# EasyEDA Pro project easyeda_project.epro, board PCB1
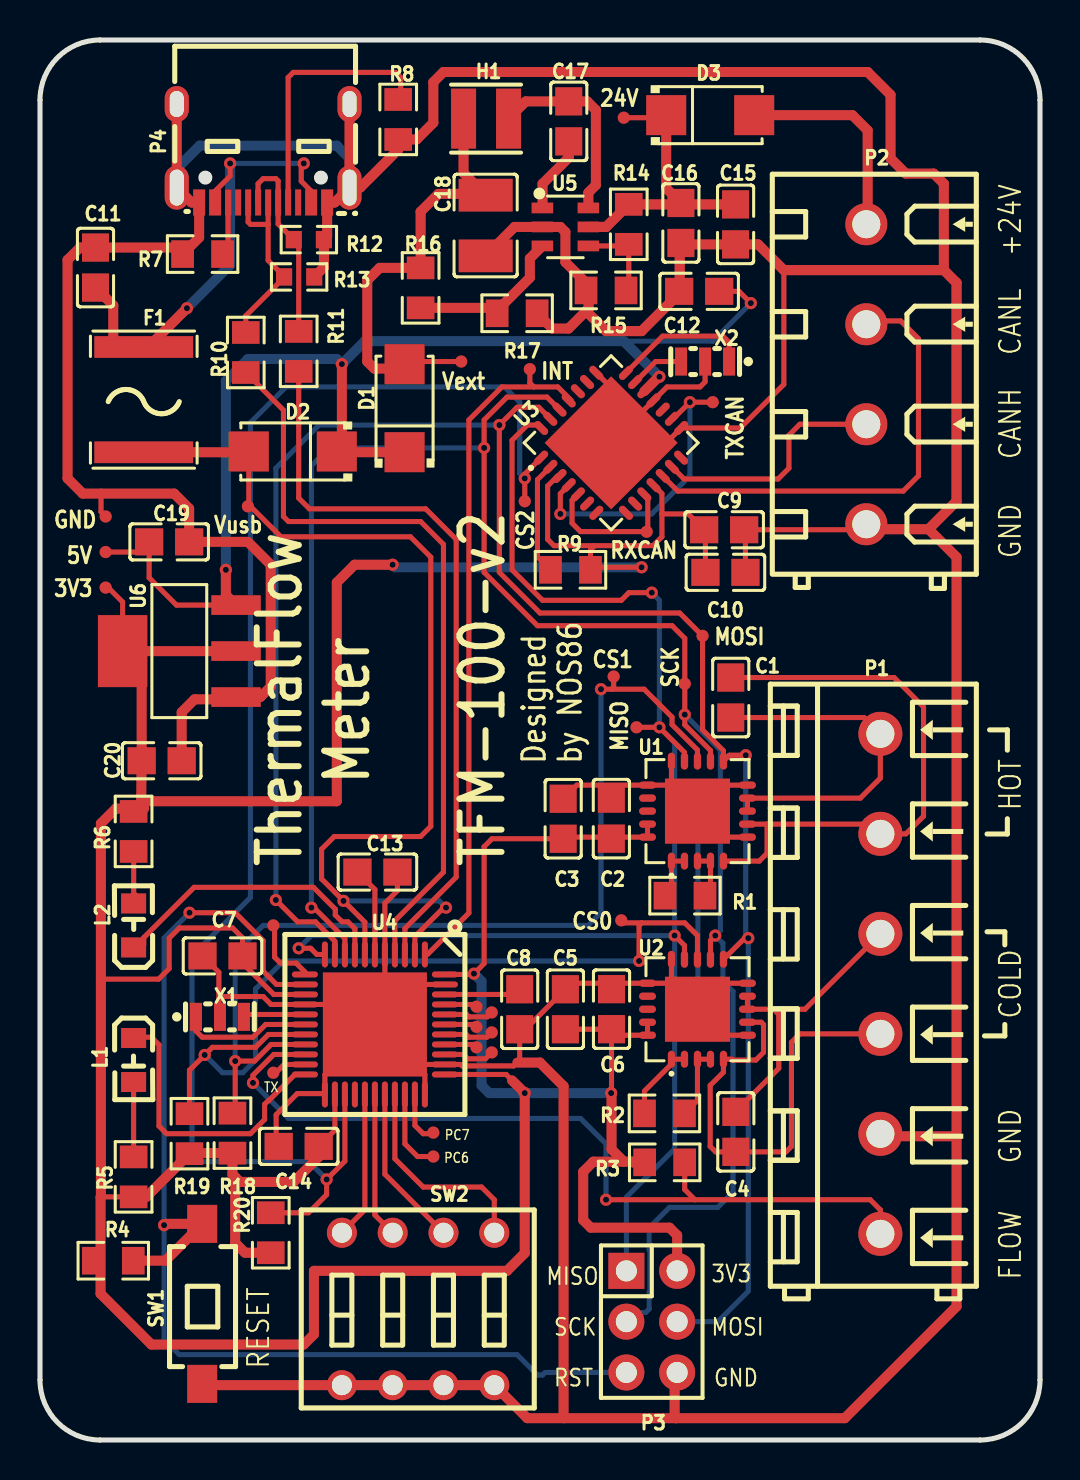
[diagram p3: board, top side]
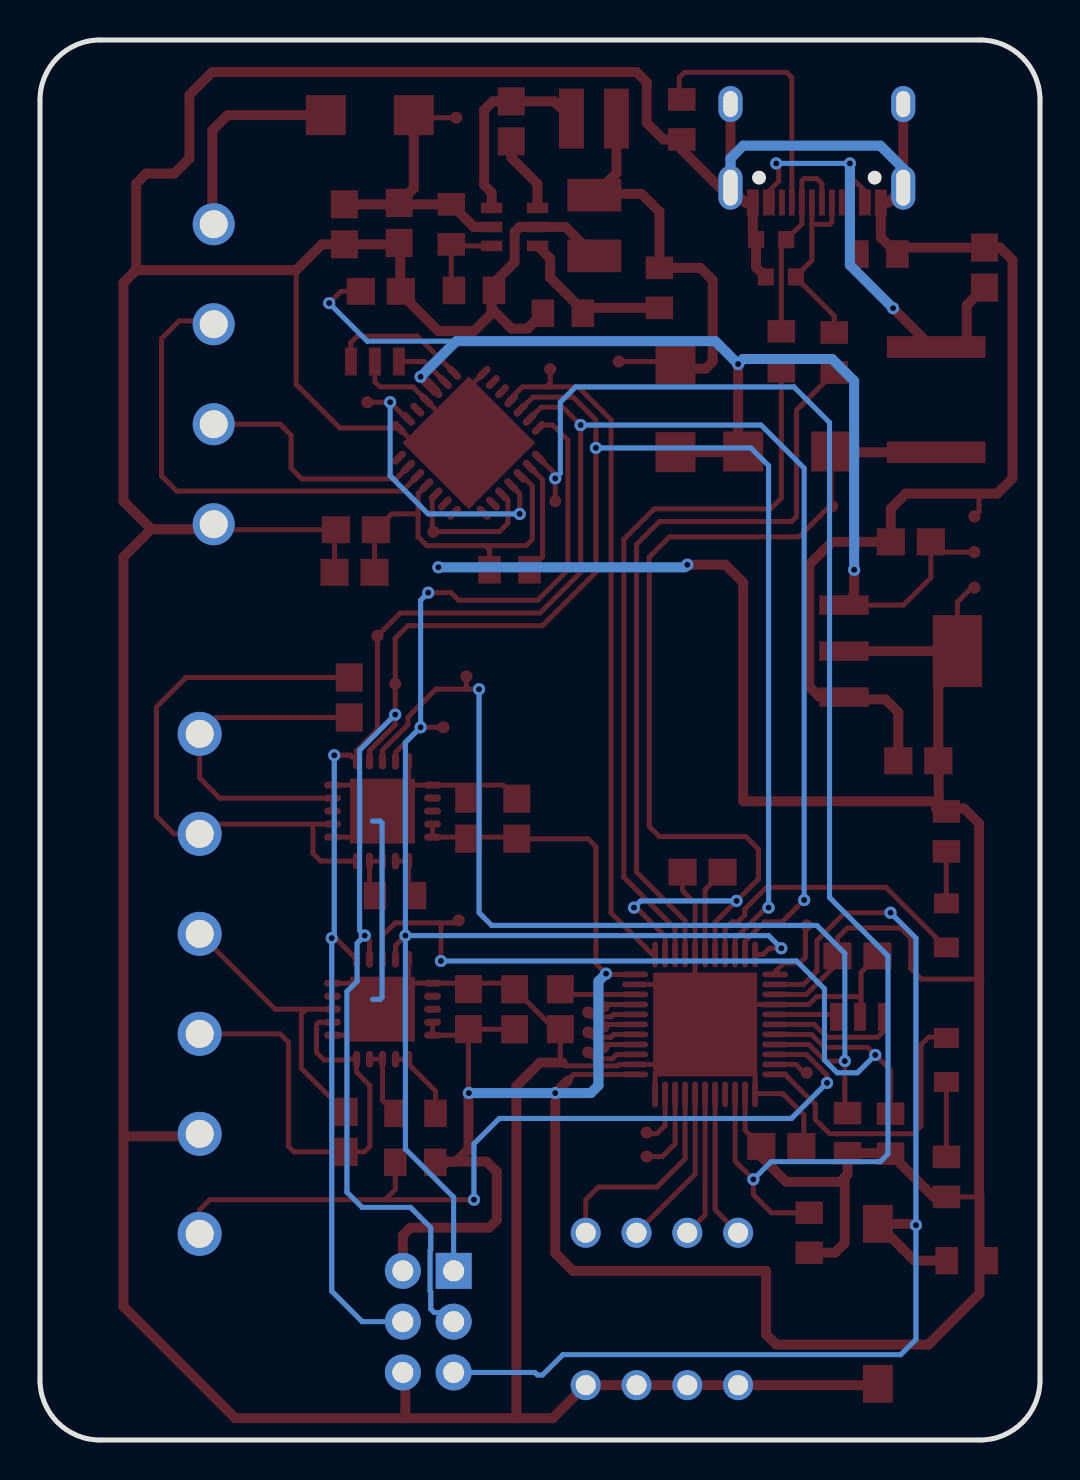
[diagram p4: board, bottom side, seen from below]

Outline 50 x 70 mm; copper layers: Top Layer, Bottom Layer. Coordinates in mm from the lower left corner of the outline.
Outline path: 0,67 arc(0.88,69.12) 3,70 47,70 arc(49.12,69.12) 50,67 50,3 arc(49.12,0.88) 47,0 3,0 arc(0.88,0.88) 0,3 0,67
Stack: Top Layer 0.035mm / Dielectric1 1.51mm FR4 er 4.5 / Bottom Layer 0.035mm

## Design rules (mm)
template: JLCPCB Capability(Two Layers Board)
spacing copperThickness1oz (default): track to track 0.102, other pairs 0.152 to 0.3
spacing copperThickness2oz: track to track 0.203, other pairs 0.152 to 0.3
track width copperThickness1oz (default): min 0.127, default 0.254, max 2.54
track width copperThickness2oz: min 0.203, default 0.254, max 2.54
differential pair differentialPair (default): width min 0.127, default 0.254, max 2.54; gap min 0.152, default 0.152
via viaSize (default): diameter min 0.5, default 0.61, max 10; hole min 0.3, default 0.305, max 6.3

## Placement (name value [footprint] x y rotation side)
C1  100nF  [C0805]  34.54 37.12 270 top
C2  100nF  [C0805]  28.57 31.07 270 top
C3  100nF  [C0805]  26.16 31.06 270 top
C4  100nF  [C0805]  34.79 15.41 270 top
C5  100nF  [C0805]  26.27 21.54 270 top
C6  100nF  [C0805]  28.58 21.54 270 top
C7  100nF  [C0805]  9.12 24.2 180 top
C8  100nF  [C0805]  23.98 21.54 270 top
C9  100nF  [C0805]  34.21 45.51 180 top
C10  100nF  [C0805]  34.27 43.38 180 top
C11  10uF  [C0805]  2.78 58.62 90 top
C12  100nF  [C0805]  32.96 57.43 180 top
C13  1uF  [C0805]  16.87 28.4 180 top
C14  1uF  [C0805]  12.94 14.68 0 top
C15  4.7uF  [C0805]  34.78 60.78 90 top
C16  100nF  [C0805]  32.04 60.85 90 top
C17  100nF  [C0805]  26.44 65.93 90 top
C18  15uF  [C1210]  22.28 60.72 90 top
C19  10uF  [C0805]  6.46 44.91 180 top
C20  22uF  [C0805]  6.09 33.96 180 top
D1  SS14  [SMA_L4.3-W2.6-LS5.1-RD]  18.23 51.59 90 top
D2  SS14  [SMA_L4.3-W2.6-LS5.1-RD]  12.64 49.43 180 top
D3  SS14  [SMA_L4.3-W2.6-LS5.1-RD]  33.51 66.24 0 top
F1  MF-SMDF050-2  [F2018]  5.19 52.02 270 top
H1  100uH  [IND-SMD_L3.5-W3.0_SLF0302]  22.3 66.07 0 top
L1  XL-2012SURC  [LED0805-RD_RED]  4.68 19 270 top
L2  XL-2012SURC  [LED0805-RD_RED]  4.68 25.73 90 top
NOREF  -  [Pad_e244]  24.49 53.54 0 top
NOREF#2  -  [Pad_e5210]  19.67 15.37 0 top
NOREF#3  -  [Pad_e318]  33.64 51.89 0 top
NOREF#4  -  [Pad_e5227]  22.59 20.38 0 top
NOREF#5  -  [Pad_e3099]  3.28 46.18 0 top
NOREF#6  -  [Pad_e5274]  11.66 25.73 0 top
NOREF#7  -  [Pad_e233]  32.24 37.81 0 top
NOREF#8  -  [Pad_e3172]  21.06 53.92 0 top
NOREF#9  -  [Pad_e5225]  21.82 19.63 0 top
NOREF#10  -  [Pad_e3178]  29.19 66.11 0 top
NOREF#11  -  [Pad_e5223]  21.82 21.67 0 top
NOREF#12  -  [Pad_e5228]  22.59 21.38 0 top
NOREF#13  -  [Pad_e3098]  3.28 44.4 0 top
NOREF#14  -  [Pad_e3100]  3.28 42.62 0 top
NOREF#15  -  [Pad_e5209]  19.67 14.17 0 top
NOREF#16  -  [Pad_e226]  29.06 25.98 0 top
NOREF#17  -  [Pad_e5224]  21.82 20.66 0 top
NOREF#18  -  [Pad_e240]  29.83 35.64 0 top
NOREF#19  -  [Pad_e245]  24.24 46.94 0 top
NOREF#20  -  [Pad_e5226]  22.59 19.38 0 top
NOREF#21  -  [Pad_e5189]  11.66 18.36 0 top
NOREF#22  -  [Pad_e3171]  10.4 46.68 0 top
NOREF#23  -  [Pad_e255]  30.33 45.41 0 top
NOREF#24  -  [Pad_e232]  28.68 38.17 0 top
NOREF#25  -  [Pad_e239]  33.13 40.21 0 top
P1  MX128-5.0-06P-GN01-Cu-Y-A  [CONN-TH_6P-P5.00_MX128-5.0-06P-GN01-CU-Y-A]  42.02 22.81 90 top
P2  MX128-5.0-04P-GN01-Cu-Y-A  [CONN-TH_4P-MX128-5.0-04P-GN01-CU-Y-A]  41.32 53.29 90 top
P3  2.54-2*3P针  [HDR-TH_6P-P2.54-V-M-R2-C3-S2.54-1]  30.59 5.92 270 top
P4  U262-161N-4BVC11  [USB-3.1-SMD_U262-161N-4BVC11]  11.16 64.34 180 top
R1  400Ω  [R0805]  32.25 27.22 180 top
R2  400Ω  [R0805]  31.22 16.33 180 top
R3  10kΩ  [R0805]  31.23 13.88 180 top
R4  10kΩ  [R0805]  3.66 8.97 0 top
R5  1kΩ  [R0805]  4.68 13.16 270 top
R6  1kΩ  [R0805]  4.68 30.43 90 top
R7  5.1kΩ  [R0805]  8.13 59.3 180 top
R8  5.1kΩ  [R0805]  17.91 66.03 90 top
R9  10kΩ  [R0805]  26.52 43.51 180 top
R10  22Ω  [R0805]  10.29 54.38 270 top
R11  22Ω  [R0805]  12.94 54.43 270 top
R12  CG0603MLC-05E  [R0603]  13.44 60.02 180 top
R13  CG0603MLC-05E  [R0603]  12.96 58.15 180 top
R14  953kΩ  [R0805]  29.44 60.78 90 top
R15  332kΩ  [R0805]  28.3 57.48 0 top
R16  95.3kΩ  [R0805]  19.03 57.61 90 top
R17  22.1kΩ  [R0805]  23.86 56.34 180 top
R18  10kΩ  [R0805]  9.62 15.34 90 top
R19  10kΩ  [R0805]  7.47 15.31 90 top
R20  10kΩ  [R0805]  11.54 10.36 90 top
SW1  TS-1101-C-W  [SW-SMD_L6.0-W3.3-LS8.0]  8.11 6.81 90 top
SW2  SMQS-04R-TP  [SW-TH_8P-P2.54_SMQS-04R-TP]  18.9 6.55 180 top
U1  MAX31865ATP+T  [QFN-20_L5.0-W5.0-P0.65-BL-EP]  32.87 31.44 0 top
U2  MAX31865ATP+T  [QFN-20_L5.0-W5.0-P0.65-BL-EP]  32.87 21.54 0 top
U3  MCP25625-E/ML  [QFN-28_L6.0-W6.0-P0.65-BL-EP]  28.56 49.86 315 top
U4  ATMEGA32U4-MU  [VQFN-44_L7.0-W7.0-P0.50-BL-EP5.2]  16.75 20.78 180 top
U5  TPS560430XDBVR  [SOT-23-6_L2.9-W1.6-P0.95-LS2.8-BL]  26.27 60.65 270 top
U6  AMS1117-3.3V  [SOT-223-4_L6.5-W3.5-P2.30-LS7.0-TR]  6.97 39.44 90 top
X1  8MHz  [OSC-SMD_3P-L3.2-W1.3-P1.20-L]  9 21.16 0 top
X2  8MHz  [OSC-SMD_3P-L3.2-W1.3-P1.20-L]  33.25 53.92 180 top

## Footprints (pads in the part's own frame, mm; a bottom-side part is the same pattern mirrored in y, then rotated)
C0805
  rect 1.41x1.35 smd: 1(-1,0) 2(1,0)
C1210
  rect 1.635x2.7 smd: 1(-1.518,0) 2(1.518,0)
CONN-TH_4P-MX128-5.0-04P-GN01-CU-Y-A
  round 2.1 hole 1.4: 1(-7.5,0) 2(-2.5,0) 3(2.5,0) 4(7.5,0)
CONN-TH_6P-P5.00_MX128-5.0-06P-GN01-CU-Y-A
  round 2.2 hole 1.4: 1(-12.5,0) 2(-7.5,0) 3(-2.5,0) 4(2.5,0) 5(7.5,0) 6(12.5,0)
F2018
  rect 1.083x4.941 smd: 1(-2.632,0) 2(2.632,0)
HDR-TH_6P-P2.54-V-M-R2-C3-S2.54-1
  rect 1.8x1.8 hole 1.05: 1(-2.54,-1.27)
  round 1.8 hole 1.05: 2(-2.54,1.27) 3(0,-1.27) 4(0,1.27) 5(2.54,-1.27) 6(2.54,1.27)
IND-SMD_L3.5-W3.0_SLF0302
  rect 1.25x3 smd: 1(-1.125,0) 2(1.125,0)
LED0805-RD_RED
  rect 1x1.25 smd: 1(-1.1,0) 2(1.1,0)
OSC-SMD_3P-L3.2-W1.3-P1.20-L
  rect 0.6x1.4 smd: 1(-1.199,0) 2(0,0) 3(1.199,0)
Pad_e226
  round 0.61 smd: TP1(0,0)
Pad_e232
  round 0.61 smd: TP2(0,0)
Pad_e233
  round 0.61 smd: TP3(0,0)
Pad_e239
  round 0.61 smd: TP4(0,0)
Pad_e240
  round 0.61 smd: TP5(0,0)
Pad_e244
  round 0.61 smd: TP6(0,0)
Pad_e245
  round 0.61 smd: TP7(0,0)
Pad_e255
  round 0.61 smd: TP8(0,0)
Pad_e318
  round 0.61 smd: TP9(0,0)
Pad_e3098
  round 0.61 smd: TP1(0,0)
Pad_e3099
  round 0.61 smd: TP2(0,0)
Pad_e3100
  round 0.61 smd: TP3(0,0)
Pad_e3171
  round 0.61 smd: TP4(0,0)
Pad_e3172
  round 0.61 smd: TP5(0,0)
Pad_e3178
  round 0.61 smd: TP6(0,0)
Pad_e5189
  round 0.61 smd: TP9(0,0)
Pad_e5209
  round 0.61 smd: TP11(0,0)
Pad_e5210
  round 0.61 smd: TP12(0,0)
Pad_e5223
  round 0.61 smd: TP13(0,0)
Pad_e5224
  round 0.61 smd: TP14(0,0)
Pad_e5225
  round 0.61 smd: TP15(0,0)
Pad_e5226
  round 0.61 smd: TP16(0,0)
Pad_e5227
  round 0.61 smd: TP17(0,0)
Pad_e5228
  round 0.61 smd: TP14(0,0)
Pad_e5274
  round 0.61 smd: TP18(0,0)
QFN-20_L5.0-W5.0-P0.65-BL-EP
  oval 0.364x0.847 smd: 1(-1.3,-2.498) 2(-0.65,-2.498) 3(0,-2.498) 4(0.65,-2.498) 5(1.3,-2.498) 11(1.3,2.498) 12(0.65,2.498) 13(0,2.498) 14(-0.65,2.498) 15(-1.3,2.498)
  oval 0.847x0.364 smd: 6(2.498,-1.3) 7(2.498,-0.65) 8(2.498,0) 9(2.498,0.65) 10(2.498,1.3) 16(-2.498,1.3) 17(-2.498,0.65) 18(-2.498,0) 19(-2.498,-0.65) 20(-2.498,-1.3)
  rect 3.25x3.25 smd: 21(0,0)
QFN-28_L6.0-W6.0-P0.65-BL-EP
  oval 0.364x0.847 smd: 1(-1.95,-2.998) 2(-1.3,-2.998) 3(-0.65,-2.998) 4(0,-2.998) 5(0.65,-2.998) 6(1.3,-2.998) 7(1.95,-2.998) 15(1.95,2.998) 16(1.3,2.998) 17(0.65,2.998) 18(0,2.998) 19(-0.65,2.998) 20(-1.3,2.998) 21(-1.95,2.998)
  oval 0.847x0.364 smd: 8(2.998,-1.95) 9(2.998,-1.3) 10(2.998,-0.65) 11(2.998,0) 12(2.998,0.65) 13(2.998,1.3) 14(2.998,1.95) 22(-2.998,1.95) 23(-2.998,1.3) 24(-2.998,0.65) 25(-2.998,0) 26(-2.998,-0.65) 27(-2.998,-1.3) 28(-2.998,-1.95)
  rect 4.7x4.7 smd: 29(0,0)
R0603
  rect 0.806x0.864 smd: 1(-0.753,0) 2(0.753,0)
R0805
  rect 1.133x1.377 smd: 1(-1,0) 2(1,0)
SMA_L4.3-W2.6-LS5.1-RD
  rect 2x2 smd: 1(-2.2,0) 2(2.2,0)
SOT-23-6_L2.9-W1.6-P0.95-LS2.8-BL
  rect 0.532x1.072 smd: 1(-0.95,-1.149) 2(0,-1.149) 3(0.95,-1.149) 4(0.95,1.149) 5(0,1.149) 6(-0.95,1.149)
SOT-223-4_L6.5-W3.5-P2.30-LS7.0-TR
  rect 0.98x2.47 smd: 1(-2.3,-2.835) 2(0,-2.835) 3(2.3,-2.835)
  rect 3.6x2.47 smd: 4(0,2.835)
SW-SMD_L6.0-W3.3-LS8.0
  rect 1.9x1.5 smd: 1(-4,0) 2(4,0)
SW-TH_8P-P2.54_SMQS-04R-TP
  round 1.5 hole 1: 1(-3.81,-3.81) 2(-1.27,-3.81) 3(1.27,-3.81) 4(3.81,-3.81) 5(3.81,3.81) 6(1.27,3.81) 7(-1.27,3.81) 8(-3.81,3.81)
USB-3.1-SMD_U262-161N-4BVC11
  rect 0.6x1.3 smd: A1B12(-3.2,2.462) A4B9(-2.4,2.462) B1A12(3.2,2.462) B4A9(2.4,2.462)
  rect 0.3x1.3 smd: A5(-1.25,2.462) A6(-0.25,2.462) A7(0.25,2.462) A8(1.25,2.462) B5(1.75,2.462) B6(0.75,2.462) B7(-0.75,2.462) B8(-1.75,2.462)
  oval 1.2x2.2 hole 0.7x1.8: SHELL(-4.32,1.719) SHELL(4.32,1.719)
  oval 1.2x1.8 hole 0.7x1.3: SHELL(-4.32,-2.462) SHELL(4.32,-2.462)
VQFN-44_L7.0-W7.0-P0.50-BL-EP5.2
  oval 0.3x1.3 smd: 1(-2.5,-3.5) 2(-2,-3.5) 3(-1.5,-3.5) 4(-1,-3.5) 5(-0.5,-3.5) 6(0,-3.5) 7(0.5,-3.5) 8(1,-3.5) 9(1.5,-3.5) 10(2,-3.5) 11(2.5,-3.5) 23(2.5,3.5) 24(2,3.5) 25(1.5,3.5) 26(1,3.5) 27(0.5,3.5) 28(0,3.5) 29(-0.5,3.5) 30(-1,3.5) 31(-1.5,3.5) 32(-2,3.5) 33(-2.5,3.5)
  oval 1.3x0.3 smd: 12(3.5,-2.5) 13(3.5,-2) 14(3.5,-1.5) 15(3.5,-1) 16(3.5,-0.5) 17(3.5,0) 18(3.5,0.5) 19(3.5,1) 20(3.5,1.5) 21(3.5,2) 22(3.5,2.5) 34(-3.5,2.5) 35(-3.5,2) 36(-3.5,1.5) 37(-3.5,1) 38(-3.5,0.5) 39(-3.5,0) 40(-3.5,-0.5) 41(-3.5,-1) 42(-3.5,-1.5) 43(-3.5,-2) 44(-3.5,-2.5)
  rect 5.2x5.2 smd: 45(0,0)

## Nets
+5V: C12.1 C19.2 D1.1 D2.1 NOREF#13.TP1 U3.19 U6.3
+24V: C15.2 C16.2 D3.1 NOREF#10.TP6 R14.2 U5.5
GND: C2.1 C3.1 C5.1 C6.1 C7.2 C8.2 C9.1 C10.1 C11.2 C12.2 C13.1 C14.1 C15.1 C16.1 C18.1 C19.1 C20.1 NOREF#5.TP2 P1.2 P2.1 P3.6 P4.A1B12 P4.B1A12 P4.SHELL R7.2 R8.1 R12.1 R13.1 R15.1 R17.1 SW1.1 SW2.5 SW2.6 SW2.7 SW2.8 U1.6 U1.10 U1.15 U1.16 U1.21 U2.6 U2.10 U2.15 U2.16 U2.21 U3.15 U3.18 U3.22 U3.29 U4.5 U4.15 U4.23 U4.33 U4.35 U4.43 U4.45 U5.2 U6.1 X1.2 X2.2
VCC: C2.2 C3.2 C5.2 C6.2 C7.1 C9.2 C10.2 C14.2 C20.2 NOREF#14.TP3 P3.2 R3.2 R4.1 R5.2 R6.2 R9.1 R18.1 R19.1 R20.1 U1.19 U1.20 U2.19 U2.20 U3.3 U3.11 U4.14 U4.24 U4.34 U4.44 U6.2 U6.4
CANH: P2.2 U3.13
CANL: P2.3 U3.12
CS0: NOREF#16.TP1 R19.2 U2.13 U4.18
CS1: NOREF#24.TP2 R18.2 U1.13 U4.19
CS2: NOREF#19.TP7 R20.2 U3.1 U4.25
D6: SW2.4 U4.27
D8: SW2.3 U4.28
D9: SW2.2 U4.29
D10: SW2.1 U4.30
D17: L2.1 U4.8
D30: L1.1 U4.22
DN: R11.2 U4.3
DP: R10.2 U4.4
FLOW: P1.1 R3.1 U4.20
INT: NOREF.TP6 U3.25 U4.1
MISO: NOREF#18.TP5 P3.1 U1.14 U2.14 U3.28 U4.11
MOSI: NOREF#25.TP4 P3.4 U1.11 U2.11 U3.27 U4.10
RESET: P3.5 R4.2 SW1.2 U4.13
SCK: NOREF#7.TP3 P3.3 U1.12 U2.12 U3.26 U4.9
VUSB: D2.2 F1.2 NOREF#22.TP4 U4.2 U4.7
$1N891: R1.2 U1.1 U1.2
$1N897: R1.1 U1.3 U1.4
$1N1195: R2.2 U2.1 U2.2
$1N1200: R2.1 U2.3 U2.4
$1N4720: C4.1 P1.4 U2.8 U2.9
$1N4751: C1.1 P1.5 U1.5 U1.7
$1N4770: C1.2 P1.6 U1.8 U1.9
$1N4790: C4.2 P1.3 U2.5 U2.7
$2N8089: U4.17 X1.1
$2N8095: U4.16 X1.3
$2N9383: C8.1 U4.42
$2N9499: C13.2 U4.6
$2N9903: L1.2 R5.1
$2N9904: L2.2 R6.1
$4N1497: C11.1 F1.1 P4.A4B9 P4.B4A9
$4N1722: P4.A5 R8.2
$4N1785: P4.B5 R7.1
$4N2171: P4.A7 P4.B7 R11.1 R12.2
$4N2188: P4.A6 P4.B6 R10.1 R13.2
$4N5071: NOREF#23.TP8 U3.5 U3.10
$4N5075: U3.20 X2.3
$4N5076: U3.21 X2.1
$4N5081: NOREF#3.TP9 U3.4 U3.16
$4N5085: R9.2 U3.2
$4N6848: C17.1 U5.1
$4N6852: C17.2 H1.2 U5.6
$4N7229: C18.2 D1.2 H1.1 NOREF#8.TP5 R16.2
$4N7245: R16.1 R17.2 U5.3
$4N7394: R14.1 R15.2 U5.4
$4N8485: D3.2 P2.4

Pads without a net: NOREF#2 TP12; NOREF#4 TP17; NOREF#6 TP18; NOREF#9 TP15; NOREF#11 TP13; NOREF#12 TP14; NOREF#15 TP11; NOREF#17 TP14; NOREF#20 TP16; NOREF#21 TP9; P4 A8 B8; U1 17 18; U2 17 18; U3 6 7 8 9 14 17 23 24; U4 12 21 26 31 32 36 37 38 39 40 41

## Via types
v1: diameter 0.61, hole 0.305, Top Layer to Bottom Layer, 38 vias

## Routing (per net, layer and track width the routed paths; a pad name or vN(x,y) marks a point on that pad's centre or on a via; arc(x,y) is an arc through that point)
+5V: length 61.5
  Top Layer w0.254: NOREF#13.TP1 4.95,44.4 C19.2 5.46,43.11 6.82,41.75 9.8,41.75 ; v1(35.54,56.84) 34.95,57.43 C12.1
  Top Layer w0.5: v1(15.09,53.8) 15.09,49.44 15.14,49.39 18.23,49.39 ; 30.22,52.44 30.94,53.16 v1(30.97,53.16) ; v1(9.29,43.51) 9.29,42.25 9.8,41.75
  Bottom Layer w0.254: 29.19,54.94 33.64,54.94 v1(35.54,56.84)
  Bottom Layer w0.5: v1(30.97,53.16) 29.19,54.94 16.24,54.94 v1(15.09,53.8) 14.84,54.05 10.4,54.05 9.29,52.95 v1(9.29,43.51)
+24V: length 14.7
  Top Layer w0.254: D3.1 31.18,66.11 NOREF#10.TP6
  Top Layer w0.5: D3.1 31.31,62.59 C16.2
  Top Layer w0.508: C15.2 29.44,61.78 R14.2 28.31,60.65 U5.5
GND: length 392.1
  Top Layer w0.254: X2.2 33.25,52.91 33,52.65 31.35,52.65 U3.18 U3.29 ; U1.6 34.17,30.14 U1.21 ; 8.95,21.99 9.12,22.17 11.16,22.17 11.55,21.78 U4.15 15.75,21.78 U4.45 ; 8.95,21.99 8.95,23.38 C7.2 ; 8.95,21.99 8.95,21.21 X1.2 ; 11.81,14.68 11.81,16.26 12.86,17.32 14.2,17.32 U4.23 14.25,18.28 U4.45 ; U3.29 31.31,49.86 U3.15 35.01,50.6 37.19,52.78 37.19,58.5 ; U3.29 28.56,52.62 U3.22 ; 18.75,18.78 U4.45 ; 18.75,18.78 19.25,18.28 U4.33 ; 18.75,18.78 U4.35 21.03,18.78 21.1,18.7 23.69,18.7 23.98,19 C8.2 24.27,20.54 C5.1 26.57,22.84 U2.16 31.57,22.84 U2.15 ; U2.6 34.17,20.24 U2.21 ; U2.21 34.17,22.84 U2.10 ; U2.21 32.37,22.04 ; U1.10 34.17,32.74 U1.21 ; P2.1 41.04,45.51 C9.1 35.27,45.45 C10.1 ; 3.05,47.32 3.05,46.41 NOREF#5.TP2 ; U1.21 32.37,31.94 ; C13.1 17.87,27.47 17.25,26.84 U4.5 17.25,21.28 18.75,22.78 U4.43 ; C3.1 26.84,32.74 U1.16 31.57,32.74 U1.15
  Top Layer w0.5: 45.83,15.19 42.14,15.19 P1.2 ; 45.83,15.19 45.83,44.14 44.43,45.54 ; 45.83,15.19 45.83,6.68 40.24,1.09 31.79,1.09 ; P4.SHELL 16.01,62.62 17.91,64.52 R8.1 18.83,65.03 19.67,65.86 19.67,67.89 20.17,68.4 41.38,68.4 42.53,67.26 42.53,64.08 43.29,63.32 44.69,63.32 45.19,62.81 45.19,58.5 ; P4.SHELL P4.SHELL ; P4.SHELL 14.73,61.88 P4.A1B12 14.36,60.18 R12.1 14.2,58.64 R13.1 ; R17.1 25.62,55.57 26.43,55.57 27.3,56.45 ; C20.1 7.09,36.39 7.73,37.03 9.69,37.03 9.8,37.14 11.02,37.14 11.54,37.67 11.54,43.76 10.4,44.91 C19.1 7.46,46.57 6.71,47.32 2.14,47.32 1.38,48.08 1.38,59 2,59.62 C11.2 6.81,59.62 R7.2 7.96,60.12 7.96,61.88 7.58,61.88 6.84,62.62 6.84,66.8 ; 31.35,3.38 31.73,3 31.73,1.16 31.79,1.09 ; C18.1 23.73,60.65 U5.2 26.02,60.65 26.27,60.4 26.27,58.89 27.43,57.73 ; 31.79,1.09 26.18,1.09 ; 26.18,1.09 26.18,17.69 25,18.87 23.87,18.87 ; 26.18,1.09 24.37,1.09 SW2.8 SW2.7 SW2.6 SW2.5 8.17,2.74 SW1.1 ; C16.1 32.12,59.78 C15.1 35.91,59.78 37.19,58.5
  Top Layer w0.508: P2.1 41.56,45.54 44.43,45.54 45.83,46.94 45.83,57.86 45.19,58.5 37.19,58.5 ; C16.1 31.99,59.79 31.99,57.35 30.08,55.45 28.3,55.45 27.3,56.45 27.43,56.57 27.43,57.73
  Bottom Layer w0.254: 33.37,22.04 32.99,22.04 32.9,22.13 32.9,30.85 32.99,30.94 33.37,30.94
  Bottom Layer w0.5: P4.SHELL 15.48,64.08 14.84,64.72 7.98,64.72 6.84,63.57 6.84,62.62
VCC: length 230
  Top Layer w0.254: 28.58,20.51 28.85,20.24 U2.20 U2.19 ; 28.58,20.51 C6.2 ; 28.58,20.51 28.58,17.34 ; 28.58,20.51 28.55,20.54 C5.2 ; C10.2 33.27,45.45 C9.2 32.42,46.3 31.1,46.3 ; 27.73,44.72 25.7,44.72 25.38,45.03 25.38,47.7 25.88,48.2 U3.3 ; 27.73,44.72 27.52,44.51 R9.1 27.65,43.64 v1(30.08,43.64) ; 27.73,44.72 30.65,44.72 31.1,45.16 31.1,46.3 ; 31.1,46.3 31.1,47.32 30.68,47.74 ; C14.2 14.75,15.49 U4.24 ; NOREF#14.TP3 3.41,42.62 4.13,41.9 U6.4 ; U4.44 21.66,23.28 v1(21.7,23.32) 22.21,23.82 22.21,29.67 22.6,30.06 C3.2 26.24,30.14 U1.20 U1.19 ; U4.14 11.69,22.28 10.12,23.84 C7.1 10.12,25.11 9.63,25.6 6.97,25.6 6.46,25.09 6.46,23.57 5.93,23.04 3.04,23.04 ; 23.6,17.98 23.31,18.28 U4.34 ; R5.2 3.04,12.16
  Top Layer w0.5: C14.2 13.94,14.16 12.68,12.9 10,12.9 9.76,13.14 ; 5.06,31.43 5.06,31.94 ; 5.06,31.43 5.21,31.58 ; 5.06,31.43 4.92,31.57 3.79,31.57 3.04,30.83 3.04,12.16 3.03,12.14 3.03,7.31 5.57,4.77 13.19,4.77 13.7,5.28 13.7,8.46 23.35,8.46 24.24,9.35 v1(24.24,17.35) 23.6,17.98 ; 5.06,31.94 5.09,34.45 ; 5.06,31.94 14.82,31.94 14.84,31.95 14.84,42.87 15.73,43.76 v1(17.63,43.76) ; 9.76,13.14 9.62,13.28 R18.1 7.5,14.34 R19.1 5.31,12.16 R5.2 ; 9.76,13.14 9.76,9.85 10.25,9.36 R20.1 ; P3.2 31.86,10.24 31.48,10.62 27.54,10.62 27.16,11 27.16,13.41 27.67,13.92 29.19,13.92 ; 29.19,13.92 28.58,14.53 28.58,17.34 28.56,17.35 v1(28.56,17.35) ; 29.19,13.92 29.6,13.92 29.64,13.88 R3.2 ; 5.09,34.45 C20.2 ; 5.09,34.45 5.09,38.49 U6.4 9.8,39.44
  Bottom Layer w0.5: v1(28.56,17.35) v1(24.24,17.35) 22.46,17.35 22.08,17.73 22.08,22.94 v1(21.7,23.32) ; v1(17.63,43.76) 17.76,43.64 v1(30.08,43.64)
(no net): length 24.5
  Top Layer w0.254: NOREF#6.TP18 11.66,25.7 11.7,25.67 11.73,25.67 11.73,24.14 12.02,23.85 12.8,23.85 13.25,23.4 U4.12 ; NOREF#15.TP11 18.88,14.17 18.25,14.81 U4.31 ; NOREF#17.TP14 21.71,20.78 U4.39 ; NOREF#11.TP13 21.71,21.78 U4.41 ; NOREF#20.TP16 22.27,19.06 21.38,19.06 21.17,19.28 U4.36 ; NOREF#9.TP15 21.68,19.78 U4.37 ; U4.21 12.21,18.78 11.79,18.36 ; NOREF#4.TP17 22.35,20.14 21.44,20.14 21.31,20.28 U4.38 ; U4.40 21.32,21.28 21.44,21.16 22.37,21.16 NOREF#12.TP14 ; NOREF#2.TP12 19.61,15.31 19.16,15.31 18.75,15.73 U4.32
CANH: length 12.1
  Top Layer w0.254: P2.2 37.99,50.79 37.45,50.24 37.45,48.59 36.91,48.05 32.2,48.05 U3.13
CANL: length 23.3
  Top Layer w0.254: P2.3 41.48,55.95 43.03,55.95 43.92,55.07 43.92,48.21 43.16,47.45 31.89,47.45 U3.12
CS0: length 42.4
  Top Layer w0.254: R19.2 7.47,18.49 v1(8.24,19.25) 8.62,19.63 10.78,19.63 11.42,20.28 U4.18 ; 30.08,25.86 32.24,25.86 32.87,25.22 U2.13 ; 30.08,25.86 29.19,25.86 NOREF#16.TP1 ; 30.08,25.86 29.95,25.73 v1(29.95,23.95)
  Bottom Layer w0.254: v1(29.95,23.95) 12.17,23.95 10.78,22.55 10.78,19 10.14,18.36 9.12,18.36 v1(8.24,19.25)
CS1: length 49.7
  Top Layer w0.254: NOREF#24.TP2 28.68,37.65 28.57,37.54 ; 28.57,37.54 v1(28.05,37.54) ; 28.57,37.54 30.21,37.54 31.6,36.14 31.6,35.77 32.87,34.5 U1.13 ; R18.2 9.76,16.48 v1(9.76,18.95) 10.72,18.95 11.55,19.78 U4.19
  Bottom Layer w0.254: v1(28.05,37.54) 28.05,26.36 27.41,25.73 11.16,25.73 9.76,24.33 v1(9.76,18.95)
CS2: length 74.5
  Top Layer w0.254: U4.25 15.25,13.94 v1(14.33,13.03) 14.33,12.27 13.43,11.36 R20.2 ; NOREF#19.TP7 v1(24.24,48.08) 24.24,48.3 U3.1
  Bottom Layer w0.254: v1(14.33,13.03) 13.44,13.92 7.98,13.92 7.6,14.3 7.6,24.2 10.52,27.13 10.52,50.88 12.3,52.65 23.22,52.65 23.98,51.89 23.98,48.33 v1(24.24,48.08)
D6: length 7.4
  Top Layer w0.254: U4.27 16.25,11.51 SW2.4
D8: length 7.3
  Top Layer w0.254: SW2.3 16.75,11.25 U4.28
D9: length 8.1
  Top Layer w0.254: U4.29 17.25,13.29 SW2.2
D10: length 10.7
  Top Layer w0.254: SW2.1 22.71,12.01 22.08,12.65 19.16,12.65 17.75,14.06 U4.30
D17: length 14.3
  Top Layer w0.254: U4.8 15.75,25.56 15.4,25.91 15.11,25.91 14.76,26.25 14.76,26.54 13.67,27.63 7.71,27.63 5.19,25.11 5.19,24.76
D30: length 14.6
  Top Layer w0.254: U4.22 12.75,18.28 11.44,16.97 11.41,16.97 11.23,16.79 11.23,16.02 10.52,15.31 6.33,15.31 5.95,15.7 5.95,19.76 5.57,20.14 4.72,20.14 L1.1
DN: length 36.9
  Top Layer w0.254: U4.3 18.25,25.58 20.81,28.14 20.81,45.03 19.28,46.56 13.47,46.56 12.94,47.1 R11.2
DP: length 38.1
  Top Layer w0.254: R10.2 12.17,51.49 12.17,46.18 12.43,45.92 19.03,45.92 20.17,44.78 20.17,28.4 17.75,25.97 U4.4
FLOW: length 42.3
  Top Layer w0.254: 32.75,12.01 41.51,12.01 42.02,11.5 P1.1 ; 32.75,12.01 v1(28.3,12.01) ; 32.75,12.01 32.23,12.53 R3.1 ; v1(10.65,17.86) 10.65,18.24 11.69,19.28 U4.20
  Bottom Layer w0.254: v1(10.65,17.86) 12.43,16.08 27.03,16.08 28.3,14.81 v1(28.3,12.01)
INT: length 34.6
  Top Layer w0.254: 24.69,52.65 24.49,52.85 NOREF.TP6 ; 24.69,52.65 23.09,52.65 21.44,51 21.44,26.35 19.37,24.28 ; 24.69,52.65 25.89,52.65 26.56,51.98
MISO: length 77.2
  Top Layer w0.254: v1(12.94,24.59) 13.53,24.59 13.84,24.28 U4.11 ; v1(30.59,42.37) 29.44,42.37 29.06,41.98 25.13,41.98 23.6,43.51 23.6,49.99 24.37,50.75 24.91,50.75 U3.28 ; U1.14 32.22,34.38 v1(30.97,35.64) NOREF#18.TP5 ; v1(31.73,25.22) 32.22,24.73 U2.14
  Bottom Layer w0.254: v1(30.59,42.37) 30.97,41.98 v1(30.97,35.64) 31.73,34.87 v1(31.73,25.22) ; 28.81,8.46 P3.1 29.32,12.14 31.73,14.55 v1(31.73,25.22) ; v1(31.73,25.22) 13.57,25.22 v1(12.94,24.59)
MOSI: length 101.3
  Top Layer w0.254: v1(35.41,25.09) 35.23,25.09 U2.11 ; U4.10 14.75,24.94 13.77,25.91 12.88,25.91 v1(11.79,27) ; v1(35.29,34.24) 34.47,34.24 U1.11 34.17,34.46 33.13,35.51 NOREF#25.TP4 31.99,41.35 25,41.35 22.97,43.38 v1(22.97,50.75) 23.86,51.64 24.94,51.64 U3.27
  Bottom Layer w0.254: v1(35.29,34.24) 35.29,25.22 v1(35.41,25.09) 35.41,7.44 33.89,5.92 31.35,5.92 ; v1(11.79,27) 11.79,48.59 13.95,50.75 v1(22.97,50.75)
RESET: length 59.5
  Top Layer w0.254: U4.13 11.82,22.78 11.16,23.44 11.16,24.97 9.76,26.36 v1(7.47,26.36)
  Top Layer w0.5: v1(6.2,10.74) 6.27,10.81 SW1.2 6.27,8.97 R4.2
  Bottom Layer w0.254: v1(7.47,26.36) 6.2,25.09 v1(6.2,10.74) 6.2,5.03 6.97,4.27 23.86,4.27 24.87,3.25 25.13,3.25 25.25,3.38 28.81,3.38
SCK: length 101.7
  Top Layer w0.254: U4.9 15.25,25.07 13.7,26.62 v1(13.57,26.62) ; U3.26 25.35,52.14 23.35,52.14 22.21,51 v1(22.21,49.61) 22.21,43.38 24.87,40.72 31.6,40.72 32.24,40.08 NOREF#7.TP3 v1(32.24,36.27) 32.24,35.76 33.52,34.48 U1.12 ; v1(33.76,25.22) 33.52,24.98 U2.12
  Bottom Layer w0.254: v1(22.21,49.61) 14.46,49.61 13.57,48.72 v1(13.57,26.62) ; 28.81,5.92 P3.3 29.77,6.37 30.28,6.37 30.46,6.55 30.46,7.41 30.5,7.44 30.5,9.47 30.46,9.51 30.46,10.62 31.48,11.63 33.89,11.63 34.65,12.39 34.65,22.43 34.14,22.94 34.14,24.84 v1(33.76,25.22) 34.02,25.47 34.02,34.49 v1(32.24,36.27)
VUSB: length 52
  Top Layer w0.254: v1(20.3,26.62) 20.18,26.62 18.75,25.18 U4.2 ; U4.7 16.25,25.89 v1(15.18,26.95) 14.08,28.05 14.08,29.54 14.71,30.17 19.03,30.17 19.54,30.68 19.54,44.14 18.52,45.16 12.05,45.16 10.44,46.77 D2.2
  Top Layer w0.5: D2.2 10.4,49.39 F1.2
  Bottom Layer w0.254: v1(20.3,26.62) 19.96,26.95 v1(15.18,26.95)
$1N891: length 2.5
  Top Layer w0.254: R1.2 31.57,27.54 U1.1 U1.2
$1N897: length 2.5
  Top Layer w0.254: R1.1 33.52,27.49 U1.4 U1.3
$1N1195: length 3.9
  Top Layer w0.254: U2.2 U2.1 31.57,18.8 30.22,17.45 R2.2
$1N1200: length 3.6
  Top Layer w0.254: U2.4 U2.3 32.87,16.98 R2.1
$1N4720: length 15
  Top Layer w0.254: 36.68,21.54 36.94,21.28 36.94,18.58 34.79,16.44 C4.1 ; 36.68,21.54 U2.8 U2.9 ; 36.68,21.54 38.25,21.54 P1.4
$1N4751: length 28.9
  Top Layer w0.254: 36.35,30.79 41.53,30.79 P1.5 43.29,30.31 44.18,31.19 44.18,36.65 42.7,38.12 C1.1 ; 36.35,30.79 U1.7 ; 36.35,30.79 36.35,29.33 35.96,28.95 U1.5
$1N4770: length 17.7
  Top Layer w0.254: C1.2 41.2,36.12 P1.6 42.02,33.09 41.02,32.09 U1.9 U1.8
$1N4790: length 23.2
  Top Layer w0.254: P1.3 37.99,20.31 37.57,19.89 37.57,14.68 37.3,14.41 C4.2 33.78,14.41 33.51,14.68 33.51,17.73 34.17,18.39 U2.5 34.61,19.04 34.65,19 35.79,19 36.18,19.38 36.18,20.78 36.06,20.89 U2.7
$2N8089: length 6.5
  Top Layer w0.254: U4.17 11.28,20.78 10.65,20.14 8.11,20.14 7.8,20.45 7.8,21.16
$2N8095: length 3.1
  Top Layer w0.254: X1.3 10.32,21.28 U4.16
$2N9383: length 3.8
  Top Layer w0.254: C8.1 23.72,22.28 U4.42
$2N9499: length 4.5
  Top Layer w0.254: U4.6 16.75,27.52 C13.2
$2N9903: length 4.4
  Top Layer w0.254: 5.06,17.9 4.68,17.52 R5.1 5.19,14.16
$2N9904: length 2.8
  Top Layer w0.254: 5.06,29.43 4.68,29.05 4.68,27.33 5.06,26.96
$4N1497: length 24.1
  Top Layer w0.254: v1(9.51,63.83) 9.51,63.19 8.76,62.44 P4.B4A9 ; 13.56,61.88 13.56,62.44 13.06,62.94 13.06,63.7 v1(13.19,63.83)
  Top Layer w0.5: v1(7.35,56.59) 5.41,54.65 3.66,54.65 3.66,56.73 C11.1
  Bottom Layer w0.254: v1(13.19,63.83) v1(9.51,63.83)
  Bottom Layer w0.5: v1(9.51,63.83) 9.51,58.75 v1(7.35,56.59)
$4N1722: length 13.3
  Top Layer w0.254: P4.A5 12.41,68.12 12.66,68.38 17.78,68.38 18.04,68.12 18.04,67.41 18.42,67.03
$4N1785: length 2.8
  Top Layer w0.254: R7.1 9.04,59.3 9.41,59.67 P4.B5
$4N2171: length 10
  Top Layer w0.254: R11.1 12.94,59.77 R12.2 11.91,60.8 P4.B7 11.91,62.95 11.79,63.07 11.16,63.07 10.9,62.81 10.9,61.88 P4.A7
$4N2188: length 9.7
  Top Layer w0.254: R10.1 10.29,56.21 12.2,58.12 R13.2 12.2,58.18 11.41,58.98 11.41,60.78 ; P4.B6 10.41,60.9 10.52,60.78 11.41,60.78 11.41,60.78 ; 11.41,60.78 P4.A6
$4N5071: length 7.5
  Top Layer w0.254: 30.21,45.42 30.39,45.6 30.39,47.11 U3.10 ; 30.21,45.42 30.33,45.42 NOREF#23.TP8 ; 30.21,45.42 27.03,45.42 26.6,45.84 26.6,46.99 U3.5
$4N5075: length 2.7
  Top Layer w0.254: 29.76,52.9 30.78,53.92 X2.3
$4N5076: length 7
  Top Layer w0.254: U3.21 31.13,55.19 34.14,55.19 34.45,54.88 X2.1
$4N5081: length 14.9
  Top Layer w0.254: U3.16 31.66,51.06 v1(32.49,51.89) NOREF#3.TP9 ; 26.44,47.74 26.02,47.32 v1(26.02,46.3)
  Bottom Layer w0.254: v1(26.02,46.3) 30.59,46.3 32.49,48.21 v1(32.49,51.89)
$4N5085: length 5.7
  Top Layer w0.254: U3.2 24.87,48.01 24.87,44.16 R9.2
$4N6848: length 3.9
  Top Layer w0.5: C17.1 26.44,64.12 25.13,62.81 25.13,61.61 U5.1
$4N6852: length 10
  Top Layer w0.5: U5.6 27.42,62.37 27.79,62.75 27.79,66.5 27.36,66.93 C17.2 24.29,66.93 H1.2
$4N7229: length 22.6
  Top Layer w0.254: D1.2 18.36,53.92 NOREF#8.TP5
  Top Layer w0.5: 21.18,66.07 21.18,63.35 22.22,62.31 ; 22.22,62.31 19.92,62.31 19.03,61.42 R16.2 16.98,58.61 16.36,57.99 16.36,53.92 16.72,53.57 18.01,53.57 D1.2 ; 22.22,62.31 C18.2
$4N7245: length 8.2
  Top Layer w0.5: U5.3 24.49,59.08 24.49,58.11 22.86,56.48 R17.2 22.59,56.61 R16.1
$4N7394: length 4.2
  Top Layer w0.254: U5.4 29.36,59.7 R14.1 29.44,57.87 29.3,57.73
$4N8485: length 10.7
  Top Layer w0.5: D3.2 40.62,66.24 41.38,65.48 41.38,60.86 P2.4

## Text on the board
Top Silkscreen Layer: TX | PC6 | PC7 | INT | RXCAN | CS2 | CS0 | CS1 | MOSI | MISO | SCK | TXCAN | 24V | GND | 3V3 | 5V | Vusb | Vext | RST | +24V | CANL | CANH | HOT | COLD | FLOW | RESET | Designed / by NOS86 | ThermalFlow / Meter / TFM-100-v2
